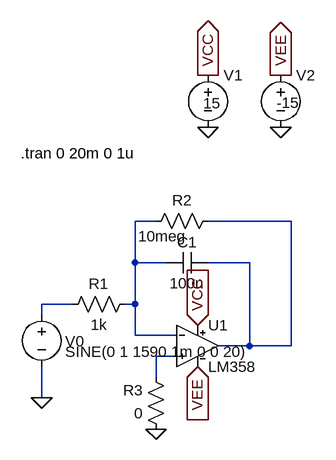
[diagram p0: schematic Integrador.asc]
Integrador.asc, the LTspice schematic file:
Version 4
SHEET 1 1048 680
WIRE 224 64 192 64
WIRE 432 64 304 64
WIRE 192 128 192 64
WIRE 240 128 192 128
WIRE 368 128 304 128
WIRE 96 192 48 192
WIRE 192 192 192 128
WIRE 192 192 176 192
WIRE 48 208 48 192
WIRE 192 240 192 192
WIRE 256 240 192 240
WIRE 368 256 368 128
WIRE 368 256 320 256
WIRE 432 256 432 64
WIRE 432 256 368 256
WIRE 256 272 224 272
WIRE 224 304 224 272
WIRE 48 336 48 288
FLAG 48 336 0
FLAG 304 -80 0
FLAG 416 -80 0
FLAG 304 -160 VCC
IOPIN 304 -160 Out
FLAG 416 -160 VEE
IOPIN 416 -160 Out
FLAG 288 224 VCC
IOPIN 288 224 In
FLAG 288 288 VEE
IOPIN 288 288 In
FLAG 224 384 0
SYMBOL res 192 176 R90
WINDOW 0 0 56 VBottom 2
WINDOW 3 32 56 VTop 2
SYMATTR InstName R1
SYMATTR Value 1k
SYMBOL res 320 48 R90
WINDOW 0 0 56 VBottom 2
WINDOW 3 24 86 VTop 2
SYMATTR InstName R2
SYMATTR Value 10meg
SYMBOL voltage 304 -176 R0
WINDOW 123 0 0 Left 2
WINDOW 39 0 0 Left 2
WINDOW 3 -7 59 Left 2
SYMATTR Value 15
SYMATTR InstName V1
SYMBOL voltage 416 -176 R0
WINDOW 123 0 0 Left 2
WINDOW 39 0 0 Left 2
WINDOW 3 -6 58 Left 2
SYMATTR Value -15
SYMATTR InstName V2
SYMBOL voltage 48 192 R0
WINDOW 0 36 57 Left 2
WINDOW 3 36 73 Left 2
WINDOW 123 5 122 Left 2
WINDOW 39 0 0 Left 2
SYMATTR InstName V0
SYMATTR Value SINE(0 1 1590 1m 0 0 20)
SYMBOL AutoGenerated\\LM358 288 192 R0
SYMATTR InstName U1
SYMBOL cap 304 112 R90
WINDOW 0 0 32 VBottom 2
WINDOW 3 32 32 VTop 2
SYMATTR InstName C1
SYMATTR Value 100n
SYMBOL res 240 400 R180
WINDOW 0 36 76 Left 2
WINDOW 3 36 40 Left 2
SYMATTR InstName R3
SYMATTR Value 0
TEXT 16 -40 Left 2 !.tran 0 20m 0 1u

The netlist it stands for:
* Integrador.asc
R1 N001 N003 1k
R2 N002 N001 10meg
V1 VCC 0 15
V2 VEE 0 -15
V0 N003 0 SINE(0 1 1590 1m 0 0 20)
XU1 N004 N001 VCC VEE N002 LM358  ; pins In+ In- V+ V- OUT
C1 N002 N001 100n
R3 0 N004 0
.tran 0 20m 0 1u
.lib LM358.lib
.backanno
.end